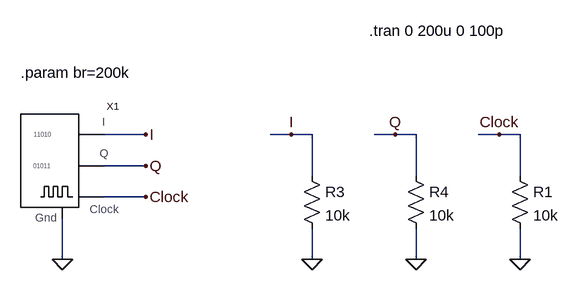
[diagram p0: schematic source_signal_random_NRZ2_test.asc]
source_signal_random_NRZ2_test.asc, the LTspice schematic file:
Version 4
SHEET 1 2032 764
WIRE 352 128 288 128
WIRE 576 128 544 128
WIRE 608 128 576 128
WIRE 736 128 704 128
WIRE 768 128 736 128
WIRE 896 128 864 128
WIRE 928 128 896 128
WIRE 352 176 288 176
WIRE 608 192 608 128
WIRE 768 192 768 128
WIRE 928 192 928 128
WIRE 352 224 288 224
WIRE 224 320 224 256
WIRE 608 320 608 272
WIRE 768 320 768 272
WIRE 928 320 928 272
FLAG 608 320 0
FLAG 768 320 0
FLAG 576 128 I
FLAG 736 128 Q
FLAG 928 320 0
FLAG 896 128 Clock
FLAG 352 128 I
FLAG 352 176 Q
FLAG 352 224 Clock
FLAG 224 320 0
SYMBOL res 592 176 R0
SYMATTR InstName R3
SYMATTR Value 10k
SYMBOL res 752 176 R0
SYMATTR InstName R4
SYMATTR Value 10k
SYMBOL res 912 176 R0
SYMATTR InstName R1
SYMATTR Value 10k
SYMBOL source_signal_random_NRZ2 240 192 R0
SYMATTR InstName X1
TEXT 160 32 Left 2 !.param br=200k
TEXT 696 -32 Left 2 !.tran 0 200u 0 100p

The netlist it stands for:
* source_signal_random_NRZ2_test.asc
R3 I 0 10k
R4 Q 0 10k
R1 Clock 0 10k
XX1 0 Clock Q I source_signal_random_NRZ2  ; pins Gnd Clock Q I
.param br=200k
.tran 0 200u 0 100p
.backanno
.end